# EAGLE board nixie_schema (EAGLE 8.2.0)
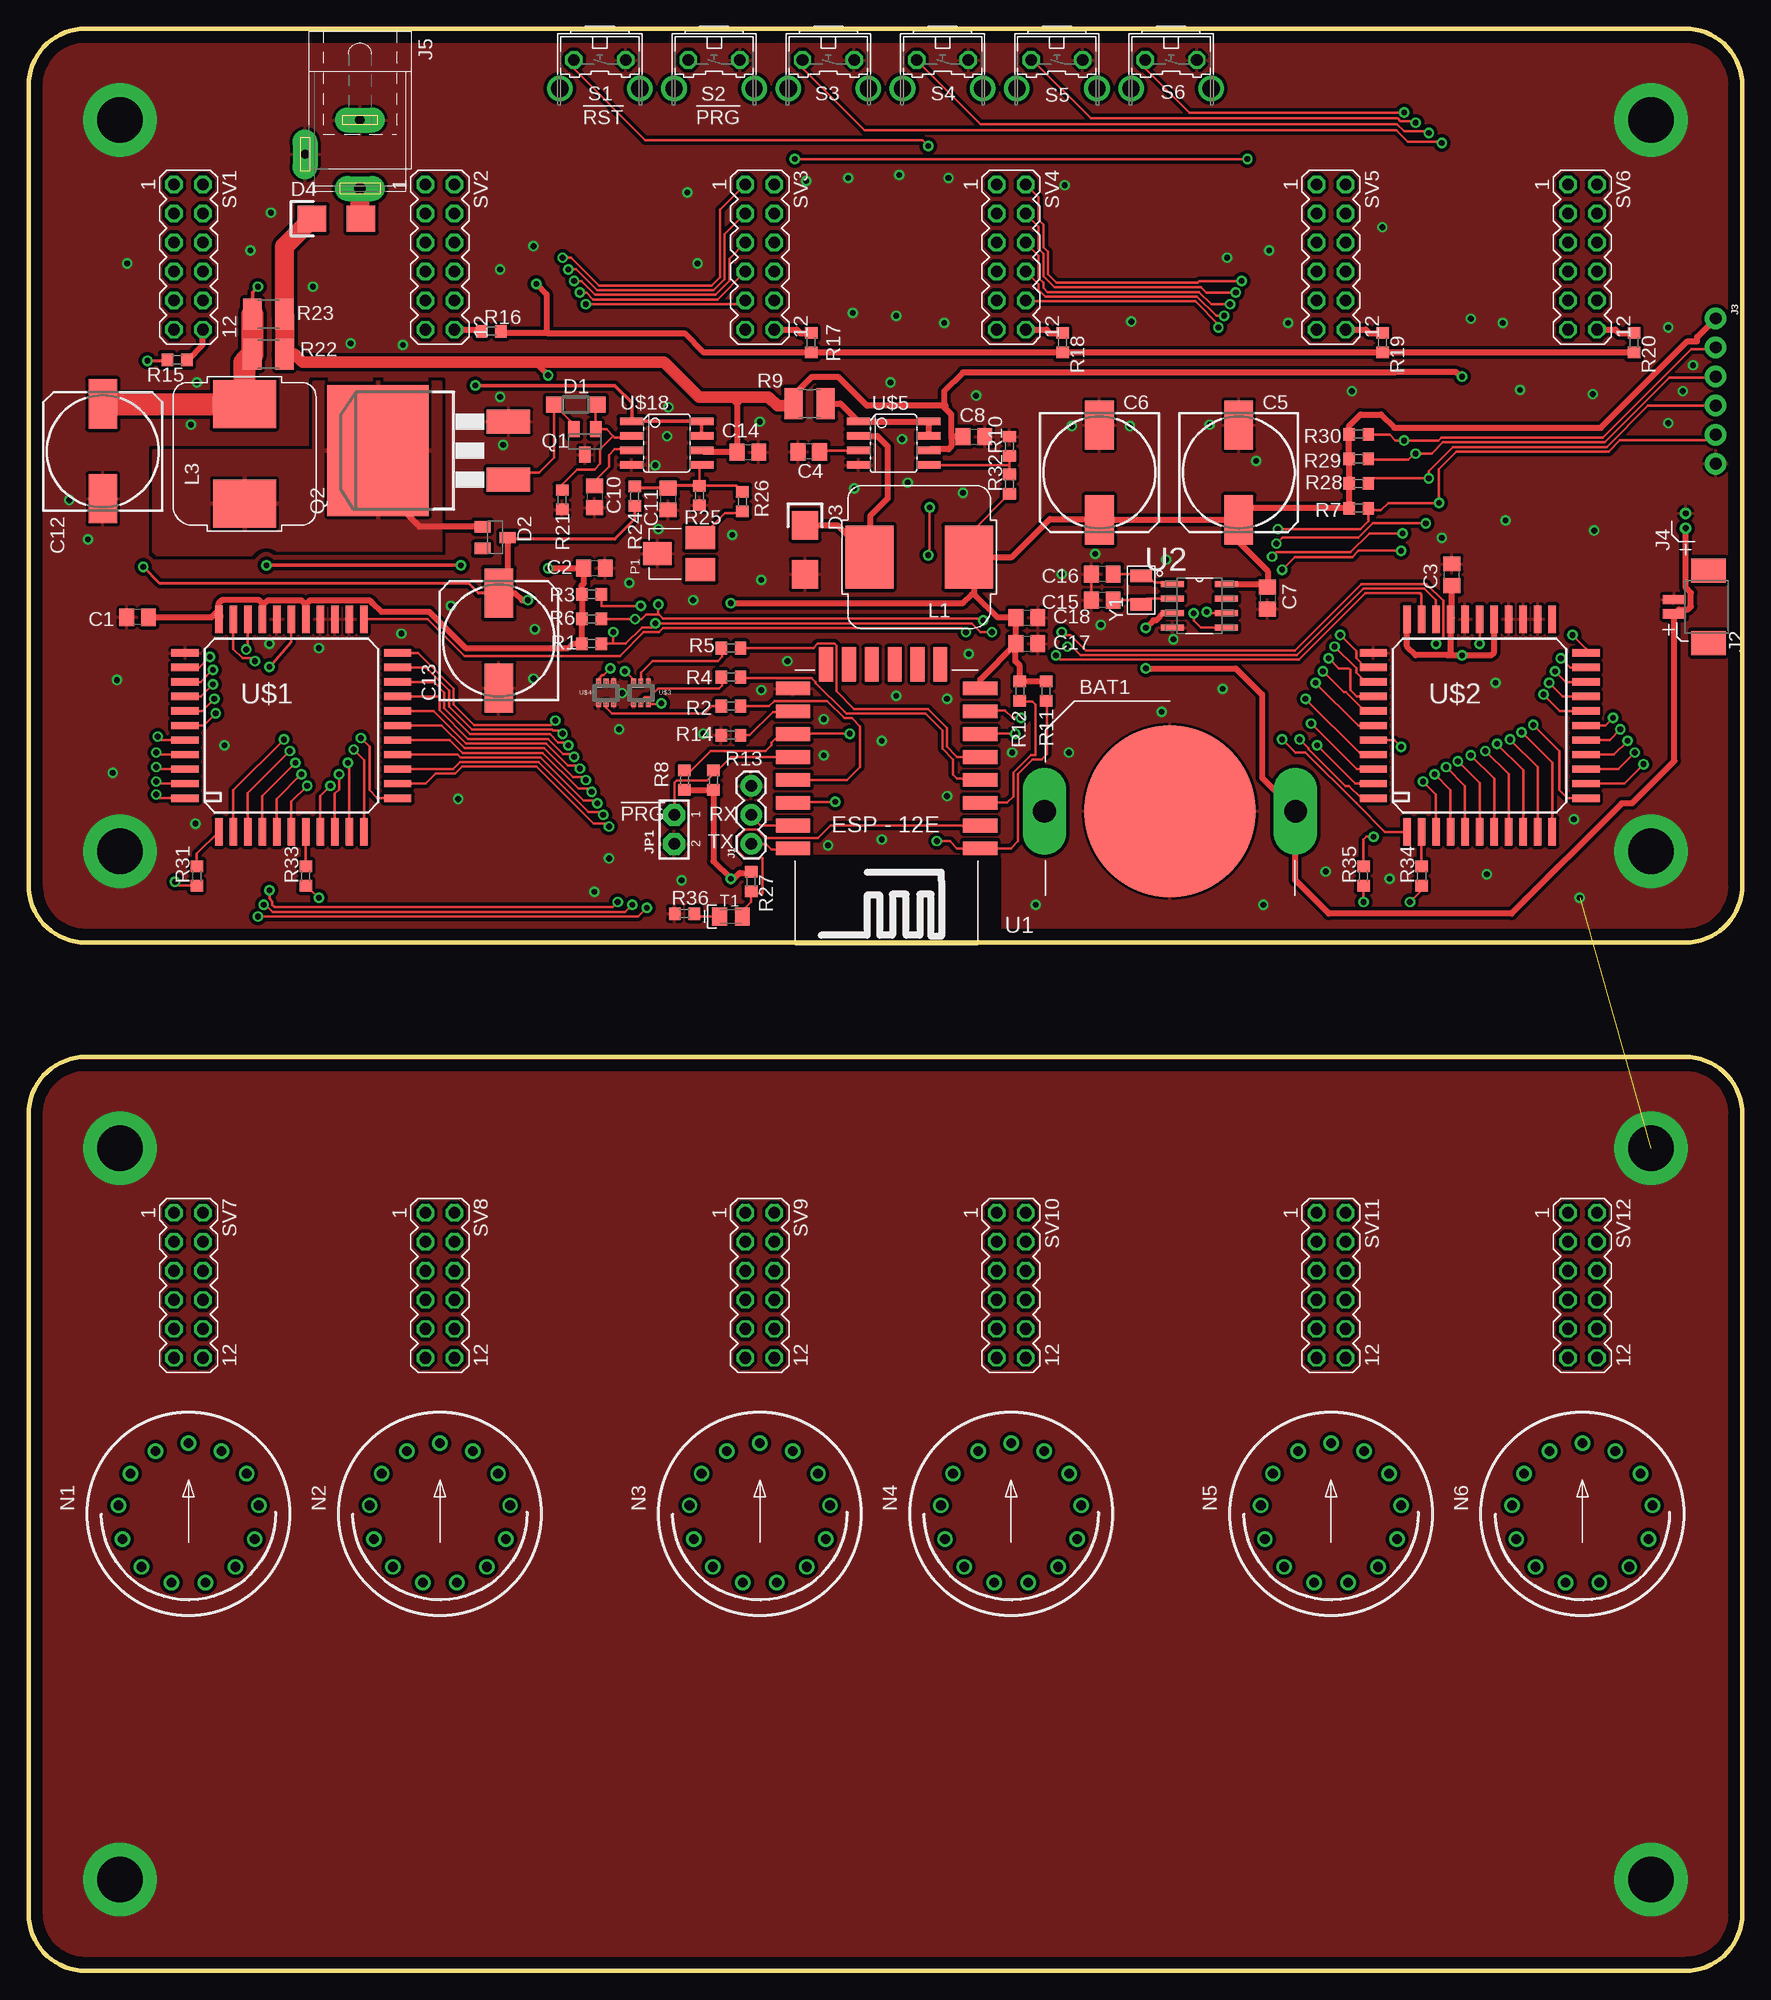
[diagram p5: board, top side]
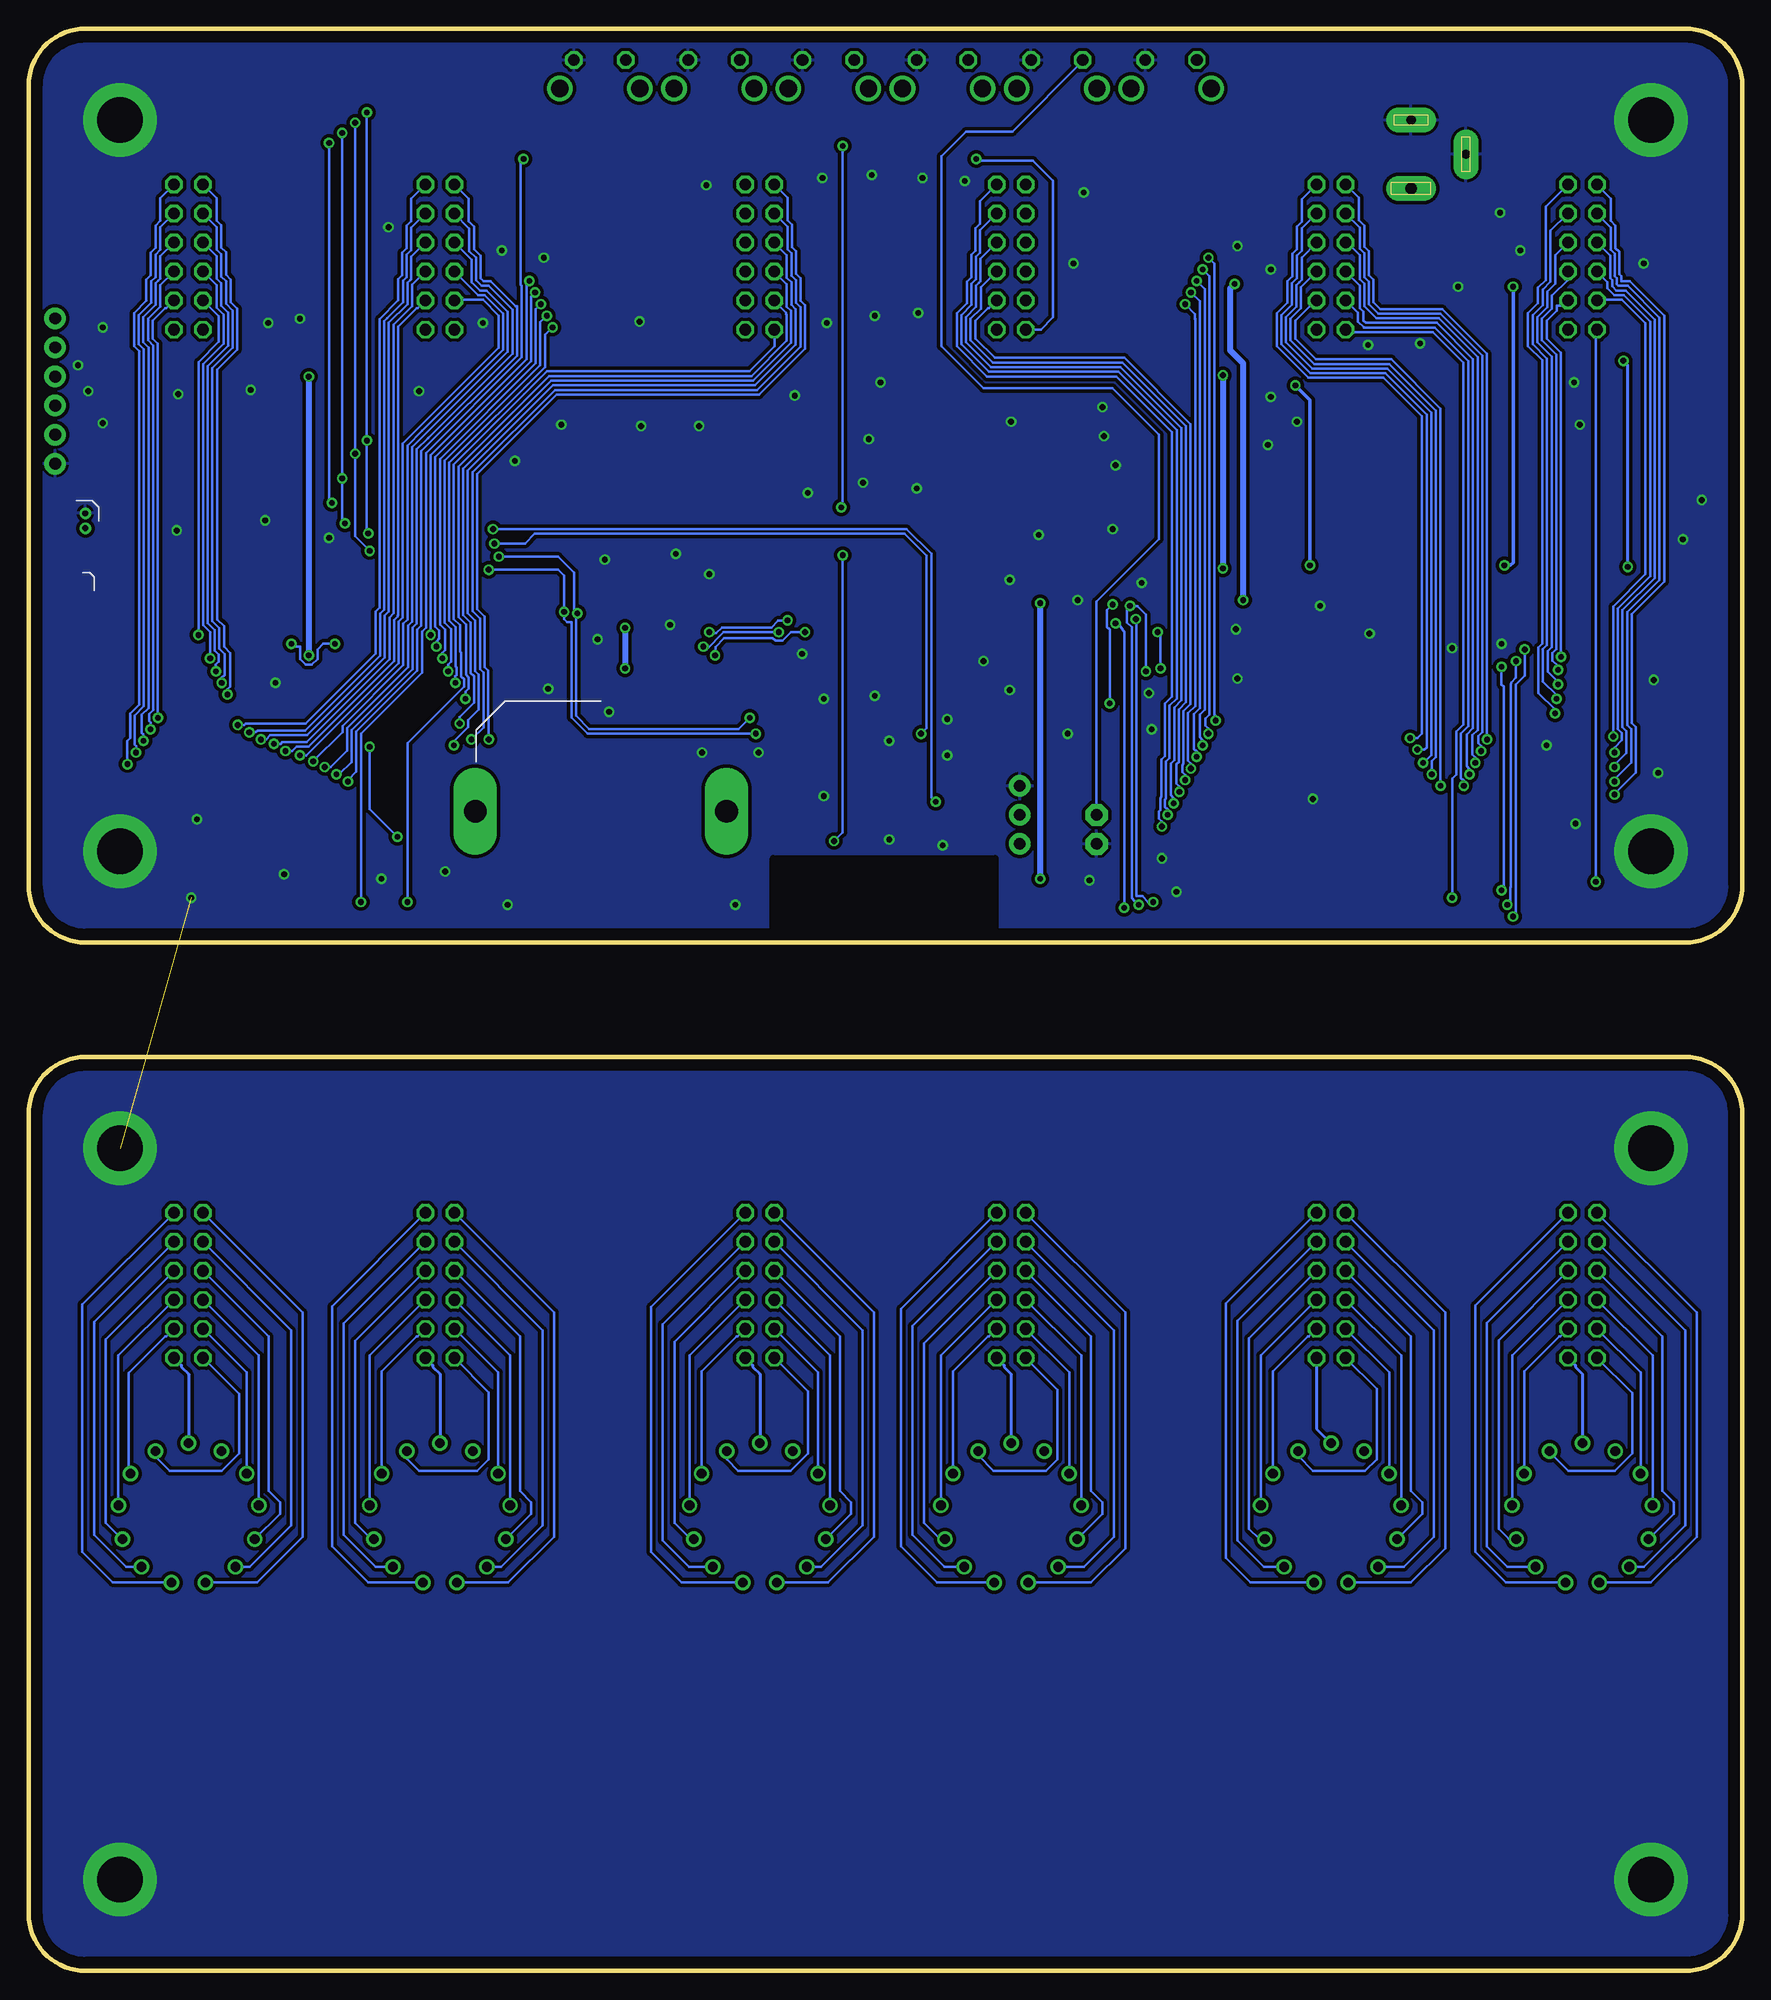
[diagram p6: board, bottom side, seen from below]

Size 150 x 170 mm. Coordinates in mm from the lower left corner, seen from the top.
Outline: 5,90 145,90 arc90 150,95 150,165 arc90 145,170 5,170 arc90 0,165 0,95 arc90 5,90
Outline: 5,0 145,0 arc90 150,5 150,75 arc90 145,80 5,80 arc90 0,75 0,5 arc90 5,0
Copper layers (1*16): Top 0.035mm / dielectric 1.5mm / Bottom 0.035mm
Design rules "default *": minimum track width 8mil, minimum drill 16mil, track to track 8mil, track to pad 8mil, pad to pad 8mil, via to via 8mil, smd to smd 8mil, copper to edge 40mil, drill to drill 8mil, minimum pad ring 10mil, minimum via ring 8mil, stop-mask expansion 4mil, vias tented up to drill 0.5mm, thermal gap 10mil
Net classes: 0 default: width 0.203 mm, drill 0.5 mm, clearance 0.203 mm; 1 Power: width 0.508 mm, drill 0.5 mm, clearance 0.203 mm; 2 HV: width 0.254 mm, drill 0.5 mm, clearance 1 mm; 3 medium power: width 0.508 mm, drill 0.5 mm, clearance 0.203 mm; 4 GND pour: width 0.305 mm, drill 0.5 mm, clearance 0.305 mm
tRestrict: area 65.4,90.3 to 84.8,97.4
bRestrict: area 65.4,90.3 to 84.8,97.4

## Footprints (pad centres in the part's own frame; a part is rotated, then mirrored left to right if it is on the bottom)
CR2032 = drill 2 pad 3.81 long: +_1 10.985,0; +_2 -10.985,0 | smd 15 x 15: - 0,0
C0805 = smd 1.3 x 1.5: 1 -0.95,0; 2 0.95,0
153CLV-1014 = smd 4.3 x 2.5: + 4.15,0; - -4.15,0
SOD123 = smd 1.4 x 1.4: A 1.9,0; C -1.9,0
SOT23 = smd 1 x 1.4: 1 -0.95,-1.1; 2 0.95,-1.1; 3 0,1.1
SMA/SMB = smd 2.5 x 2.3: A 2.15,0; C -2.15,0
1X03 = drill 1.016 pad 1.88: 1 0,0; 2 2.54,0; 3 5.08,0
PICOBLADE_SMD_2 = smd 0.8 x 2: + -0.625,3; - 0.625,3 | smd 2.1 x 3: CHAS_1 -3.175,0; CHAS_2 3.175,0
1X06_NO_SILK = drill 1.016 pad 1.88: 1 0,0; 2 2.54,0; 3 5.08,0; 4 7.62,0; 5 10.16,0; 6 12.7,0
PICOBLADE_THT_2 = drill 0.5: + -0.625,0; - 0.675,0
SPC4077 = drill 0.8 pad 2.184 long: 1 -3,0; 2 0,-4.8 | drill 1 pad 2.184 long: 3 3,0
JUMPER2 = drill 1 pad 1.93 octagon: 1 2.54,0; 2 0,0
INDUCTOR_PACKAGE = smd 5.5 x 4.2: P$1 0,4.35; P$2 0,-4.35
IN-14 = drill 0.84: 0 -5.094,-3.516; 1 5.094,-3.516; 2 6.145,-0.746; 3 5.788,2.195; 4 4.105,4.633; 5 1.481,6.01; 6 -1.481,6.01; 7 -4.105,4.633; 8 -5.788,2.195; 9 -6.145,-0.746; A 0,-6.19; LHDP 2.877,-5.481; RHDP -2.877,-5.481
UNI_POT_SMD = smd 2 x 2.6: P$1 -1.4,-1.9; P$3 1.4,-1.9 | smd 2 x 2.5: P$2 0,1.85
D2PACK = smd 2.083 x 3.81: 1 -2.54,-8.89; 3 2.54,-8.89 | smd 11.43 x 8.89: 2 0,2.54
R0603 = smd 1 x 1.1: 1 -0.85,0; 2 0.85,0
R1210 = smd 1.6 x 2.7: 1 -1.4,0; 2 1.4,0
B3F-31XX = drill 1.016 octagon: 1 -2.261,-1.245; 2 2.261,-1.245 | drill 1.499 pad 2.159: 3 -3.505,1.245; 4 3.505,1.245
MA06-2 = drill 1.016 octagon: 1 -6.35,-1.27; 2 -6.35,1.27; 3 -3.81,-1.27; 4 -3.81,1.27; 5 -1.27,-1.27; 6 -1.27,1.27; 7 1.27,-1.27; 8 1.27,1.27; 9 3.81,-1.27; 10 3.81,1.27; 11 6.35,-1.27; 12 6.35,1.27
C0805K = smd 1.3 x 1.6: COL 1,0; EMI -1,0
ESP12E-SMD = smd 3 x 1.2: ADC -8.3,3.8; CH_PD -8.3,1.8; GND 8.1,-8.2; GPIO0 8.1,-2.2; GPIO2 8.1,-4.2; GPIO4 8.1,-0.2; GPIO5 8.1,1.8; GPIO12 -8.3,-4.2; GPIO13 -8.3,-6.2; GPIO14 -8.3,-2.2; GPIO15 8.1,-6.2; GPIO16 -8.3,-0.2; RESET -8.3,5.8; RXD0 8.1,3.8; TXD0 8.1,5.8; VCC -8.3,-8.2 | smd 1.2 x 3: CS0 -4.8,-10.3; GPIO9 -0.8,-10.3; GPIO10 1.2,-10.3; MISO -2.8,-10.3; MOSI 3.2,-10.3; SCLK 5.2,-10.3
SOIC8-N_MC = smd 1.981 x 0.559: 1 -2.362,1.905; 2 -2.362,0.635; 3 -2.362,-0.635; 4 -2.362,-1.905; 5 2.362,-1.905; 6 2.362,-0.635; 7 2.362,0.635; 8 2.362,1.905
CQFP-44 = smd 0.65 x 2.4: 1 -6.35,-9.3; 2 -5.08,-9.3; 3 -3.81,-9.3; 4 -2.54,-9.3; 5 -1.27,-9.3; 6 0,-9.3; 7 1.27,-9.3; 8 2.54,-9.3; 9 3.81,-9.3; 10 5.08,-9.3; 11 6.35,-9.3; 23 6.35,9.3; 24 5.08,9.3; 25 3.81,9.3; 26 2.54,9.3; 27 1.27,9.3; 28 0,9.3; 29 -1.27,9.3; 30 -2.54,9.3; 31 -3.81,9.3; 32 -5.08,9.3; 33 -6.35,9.3 | smd 2.4 x 0.65: 12 9.3,-6.35; 13 9.3,-5.08; 14 9.3,-3.81; 15 9.3,-2.54; 16 9.3,-1.27; 17 9.3,0; 18 9.3,1.27; 19 9.3,2.54; 20 9.3,3.81; 21 9.3,5.08; 22 9.3,6.35; 34 -9.3,6.35; 35 -9.3,5.08; 36 -9.3,3.81; 37 -9.3,2.54; 38 -9.3,1.27; 39 -9.3,0; 40 -9.3,-1.27; 41 -9.3,-2.54; 42 -9.3,-3.81; 43 -9.3,-5.08; 44 -9.3,-6.35
SOT-363 = smd 0.42 x 0.6: 1 -0.65,-0.95; 2 0,-0.95; 3 0.65,-0.95; 4 0.65,0.95; 5 0,0.95; 6 -0.65,0.95
SOIC08 = smd 0.66 x 2.032: 1 -1.905,-3.073; 2 -0.635,-3.073; 3 0.635,-3.073; 4 1.905,-3.073; 5 1.905,3.073; 6 0.635,3.073; 7 -0.635,3.073; 8 -1.905,3.073
CRYSTAL_PACK = smd 1.1 x 1.9: P$1 -1.25,0; P$2 1.25,0

## Placement (x,y rotation side)
BAT1  CR2032  [CR2032]  99.91,101.5 0 top
C1  100n  [C0805]  9.54,118.47 180 top
C2  100n  [C0805]  49.53,122.77 0 top
C3  100n  [C0805]  124.58,122.2 90 top
C4  270p  [C0805]  68.29,132.96 180 top
C5  100u  [153CLV-1014]  105.92,131.15 270 top
C6  100u  [153CLV-1014]  93.73,131.15 270 top
C7  100n  [C0805]  108.42,120.15 270 top
C8  100n  [C0805]  82.74,134.29 0 top
C10  680p  [C0805]  49.54,129.02 270 top
C11  10n  [C0805]  55.98,128.82 270 top
C12  220u  [153CLV-1014]  6.5,133 90 top
C13  2.2u  [153CLV-1014]  41.16,116.44 90 top
C14  100n  [C0805]  62.96,132.94 0 top
C15  [C0805]  93.98,119.97 180 top
C16  [C0805]  93.98,122.26 180 top
C17  100n  [C0805]  87.38,116.16 0 top
C18  100n  [C0805]  87.38,118.45 0 top
D1  [SOD123]  47.9,137.09 0 top
D2  BAS21  [SOT23]  40.83,125.45 270 top
D3  B230A-13-F  [SMA/SMB]  67.96,124.38 270 top
D4  B230A-13-F  [SMA/SMB]  26.95,153.35 0 top
J1  [1X03]  63.25,98.64 90 top
J2  [PICOBLADE_SMD_2]  147.05,119.39 90 top
J3  [1X06_NO_SILK]  147.67,144.62 270 top
J4  [PICOBLADE_THT_2]  145.04,126.89 90 top
J5  [SPC4077]  29,159 270 top
JP1  [JUMPER2]  56.52,98.64 90 top
L1  100u  [INDUCTOR_PACKAGE]  77.95,123.75 90 top
L3  150u  [INDUCTOR_PACKAGE]  18.9,132.78 0 top
N1  IN-14_FIXED  [IN-14]  14,40 180 top
N2  IN-14_FIXED  [IN-14]  36,40 180 top
N3  IN-14_FIXED  [IN-14]  64,40 180 top
N4  IN-14_FIXED  [IN-14]  86,40 180 top
N5  IN-14_FIXED  [IN-14]  114,40 180 top
N6  IN-14_FIXED  [IN-14]  136,40 180 top
P1  100k  [UNI_POT_SMD]  56.9,124.04 90 top
Q1  BC856B  [SOT23]  48.69,133.83 180 top
Q2  IRF740S  [D2PACK]  33.12,133.06 90 top
R1  2.2k  [R0603]  49.28,116.16 0 top
R2  2.2k  [R0603]  61.47,110.7 180 top
R3  2.2k  [R0603]  49.28,120.48 0 top
R4  2.2k  [R0603]  61.47,113.24 180 top
R5  2.2k  [R0603]  61.47,115.78 180 top
R6  2.2k  [R0603]  49.28,118.32 0 top
R7  2.2K  [R0603]  116.42,128.02 180 top
R8  [R0603]  57.4,104.22 90 top
R9  0.5R  [R1210]  68.35,137.17 0 top
R10  3.3k  [R0603]  85.85,133.43 90 top
R11  [R0603]  89.05,112.01 90 top
R12  [R0603]  86.77,112.01 90 top
R13  [R0603]  59.94,104.22 90 top
R14  [R0603]  61.47,108.16 0 top
R15  10k  [R0603]  13,141 180 top
R16  10k  [R0603]  40.5,143.5 0 top
R17  10k  [R0603]  68.5,142.5 270 top
R18  10k  [R0603]  90.5,142.5 270 top
R19  10k  [R0603]  118.5,142.5 270 top
R20  10k  [R0603]  140.5,142.5 270 top
R21  1k  [R0603]  46.71,128.75 270 top
R22  0.5R  [R1210]  21,141.5 180 top
R23  0.5R  [R1210]  21,145 180 top
R24  330k  [R0603]  53.05,129.09 90 top
R25  3.3k  [R0603]  58.71,129.14 270 top
R26  5.6k  [R0603]  62.48,128.61 270 top
R27  [R0603]  63.25,95.33 270 top
R28  2.2K  [R0603]  116.42,130.18 180 top
R29  2.2K  [R0603]  116.42,132.34 180 top
R30  2.2K  [R0603]  116.42,134.5 180 top
R31  68k  [R0603]  14.73,95.84 90 top
R32  5.6k  [R0603]  85.85,130.13 90 top
R33  68k  [R0603]  24.26,95.84 90 top
R34  68k  [R0603]  121.92,95.84 90 top
R35  68k  [R0603]  116.84,95.84 90 top
R36  [R0603]  57.4,92.54 180 top
S1  [B3F-31XX]  50,166 180 top
S2  [B3F-31XX]  60,166 180 top
S3  [B3F-31XX]  70,166 180 top
S4  [B3F-31XX]  80,166 180 top
S5  [B3F-31XX]  90,166 180 top
S6  [B3F-31XX]  100,166 180 top
SV1  [MA06-2]  14,150 270 top
SV2  [MA06-2]  36,150 270 top
SV3  [MA06-2]  64,150 270 top
SV4  [MA06-2]  86,150 270 top
SV5  [MA06-2]  114,150 270 top
SV6  [MA06-2]  136,150 270 top
SV7  [MA06-2]  14,60 270 top
SV8  [MA06-2]  36,60 270 top
SV9  [MA06-2]  64,60 270 top
SV10  [MA06-2]  86,60 270 top
SV11  [MA06-2]  114,60 270 top
SV12  [MA06-2]  136,60 270 top
T1  [C0805K]  61.47,92.29 0 top
U1  [ESP12E-SMD]  75,104.05 180 top
U2  MC7940N  [SOIC8-N_MC]  102.48,119.47 0 top
U$1  HV5522  [CQFP-44]  23,109 0 top
U$2  HV5522  [CQFP-44]  127,109 0 top
U$3  BSS138DW  [SOT-363]  53.59,111.84 0 top
U$4  BSS138DW  [SOT-363]  50.55,111.84 0 top
U$5  MC34063  [SOIC08]  75.71,133.7 270 top
U$18  MC34063  [SOIC08]  55.85,133.73 270 top
Y1  [CRYSTAL_PACK]  97.39,120.86 90 top

## Tracks (layer width: path | path; a pad name or v marks a point on that pad's centre or on a via)
+3V3  (via drill 0.5)
  Top 0.203: L1.P$2 82.3,125.73 R32.1
  Top 0.508: C5.+ C6.+ 93.64,127.08 89.41,127.08 86.07,123.75 L1.P$2 82.8,123.24 82.8,120.48 | 83.57,112.52 U1.VCC 83.3,113.04 C17.1 | C17.1 C18.1 84.84,118.45 82.8,120.48 | U2.8 108.14,121.38 C7.1 108.46,121.14 108.46,122.51 105.92,125.05 C5.+ | 82.8,120.48 82.55,120.48 81.79,119.72 v61.47,119.72 | R27.1 63.16,96.1 62.23,96.1 61.47,95.33 v61.47,95.59 59.94,97.11 R13.1 R8.1 | R11.2 R12.2 86.77,114.23 86.36,114.64 86.36,116.1 C17.1 | C5.+ 106.94,128.02 R7.2 R28.2 R29.2 R30.2 115.57,135.21 116.59,136.23 118.36,136.23 119.54,135.06 137.61,135.06 145.18,142.63 146.05,142.63 146.05,143 J3.1
  Bottom 0.508: v61.47,119.72 v61.47,95.59
BUTTON1  (via drill 0.5)
  Top 0.203: S3.2 67.74,166.53 73.15,161.12 119.7,161.12 120.71,160.11 123.57,160.11 v123.7,159.98 | J3.5 147.18,133.97 139.29,133.97 138.3,132.98 124.97,132.98 123.44,131.45 v123.44,128.48 119,128.48 118.36,127.85 117.44,127.85 R7.1 117.27,126.88 116.59,126.19 v109.35,126.19 | v109.35,126.19 109.22,126.19 109.09,126.07 109.22,126.07 v109.35,126.19 | v70.61,102.32 66.97,102.32 U1.GPIO5
  Bottom 0.203: v123.7,159.98 123.7,128.74 v123.44,128.48 | v109.35,126.19 73.15,126.19 70.99,124.04 70.99,102.7 v70.61,102.32
BUTTON2  (via drill 0.5)
  Top 0.203: R8.2 58,105.07 59.69,106.76 64.52,106.76 65.02,107.27 65.02,107.53 65.53,108.03 66.68,108.03 U1.GPIO2 66.94,108.29 v71.88,108.29 | S4.2 77.74,167.2 83.31,161.63 119.77,161.63 120.4,161 122.42,161 v122.56,160.87 | R28.1 117.73,130.64 v122.56,130.64 122.56,131.28 124.66,133.38 138.13,133.38 141.74,136.99 147.66,136.99 J3.4 | v122.3,126.7 117.67,126.7 116.4,125.44 109.73,125.44 v109.22,124.92
  Bottom 0.203: v122.56,160.87 v122.56,130.64 122.56,126.96 v122.3,126.7 | v109.22,124.92 106.55,124.92 105.69,125.79 73.32,125.79 71.41,123.88 71.41,121.66 71.4,121.65 71.4,108.77 v71.88,108.29
BUTTON3  (via drill 0.5)
  Top 0.203: v86.36,108.29 84.2,108.29 83.82,107.91 83.64,107.91 U1.GPIO12 | 104.84,118.83 U2.6 103.24,118.84 v103.12,118.96 | S5.2 87.86,167.25 92.96,162.14 119.83,162.14 120.08,161.89 121.28,161.89 v121.41,161.75 | R29.1 117.31,132.29 120.78,132.29 121.28,132.8 v121.41,132.8 122.81,132.8 123.8,133.79 137.96,133.79 143.61,139.43 147.56,139.43 J3.3 | v120.14,124.29 116.41,124.29 115.88,123.76 110.85,123.76 v109.73,122.64
  Bottom 0.203: v86.36,108.29 101.09,108.29 102.49,109.69 102.49,118.07 102.87,118.07 103.12,118.32 v103.12,118.96 103.12,122.13 103.63,122.64 v109.73,122.64 | v121.41,161.75 v121.41,132.8 121.41,125.56 v120.14,124.29
BUTTON4  (via drill 0.5)
  Top 0.203: v86.87,109.69 86.11,109.69 85.47,110.32 83.37,110.32 U1.GPIO13 | U2.5 104.84,117.56 102.62,117.56 101.98,118.19 v101.98,118.83 | S6.2 97.74,166.5 101.6,162.64 v120.4,162.64 | 117.57,134.2 R30.1 117.31,134.45 119.13,134.45 119.63,133.94 v120.4,133.94 123.38,133.94 123.63,134.2 137.79,134.2 145.54,141.94 147.53,141.94 J3.2 | v120.27,125.81 117.35,125.81 115.71,124.17 109.22,124.17 v108.84,123.78
  Bottom 0.203: v86.87,109.69 87.85,108.7 100.93,108.7 102.08,109.85 102.08,118.73 v101.98,118.83 102.23,119.08 102.23,122.38 103.63,123.78 v108.84,123.78 | v120.4,162.64 v120.4,133.94 120.4,125.94 v120.27,125.81
DATA_CLK
  Top 0.203: R5.1 68.7,115.78 69.07,116.16 70.53,116.16 70.7,115.98 70.7,112 72.26,110.45 78.74,110.45 80.39,108.8 80.39,107.14 81.28,106.26 U1.GPIO14 | U1.GPIO14
DATA_IN
  Top 0.203: R4.1 62.4,113.16 68.53,113.16 68.89,112.79 68.89,112.72 71.4,110.22 71.58,110.04 78.49,110.04 79.98,108.54 79.98,106.98 80.93,106.03 80.93,104.7 81.28,104.35 83.2,104.35 U1.GPIO16
GND  (via drill 0.5, 4 pad 6.45)  (1 unrouted)
  Top 0.203: C15.2 93.03,122.07 93.22,122.26
  other vias: 142,98 142,162 8,162 8,98 142,72 142,8 8,8 8,72 21.08,116.16 25.4,115.78 44.32,117.43 51.94,111.84 41.27,137.75 38.99,135.59 41.53,133.56 100.2,116.54 64.14,112.1 54.86,131.78 36.96,119.46 44.2,113.11 32.64,117.05 59.05,108.29 96.39,135.21 91.31,135.21 103.38,135.34 107.44,132.16 90.42,122.26 75.95,111.59 74.68,107.65 74.68,99.02 80.39,102.83 113.54,96.22 75.44,139.02 96.52,144.36 143.51,135.47 82.93,137.88 115.82,138.26 130.56,138.39 136.91,138.01 137.03,126.07 126.24,144.61 129.03,144.23 143.51,143.85 129.29,126.96 128.4,112.73 127.64,95.97 135.76,93.94 88.14,93.3 57.15,95.46 50.8,97.37 37.59,102.57 17.14,107.27 14.61,100.41 7.37,104.86 7.75,112.99 5.21,125.31 3.56,128.74 8.64,149.44 19.43,150.58 21.21,153.88 24.89,147.4 41.27,148.93 44.2,150.96 58.55,149.44 57.66,155.66 68.07,156.68 72.14,145.12 75.95,144.86 76.2,157.18 71.75,156.93 80.14,144.23 80.52,156.93 90.68,156.29 104.9,149.94 108.58,150.58 118.49,152.61 81.79,129.37 72.26,129.75 64.01,135.59 61.59,125.69 55.88,134.32 56.01,136.86 76.45,134.07 76.96,130.26 64.14,121.75 58.17,119.97 80.39,111.34 69.98,98.51 49.53,94.44 51.69,108.67 14.22,135.34 14.73,139.02 28.19,142.45 32.77,142.32 110.24,144.23 135.25,100.8 108.08,93.3 104.52,112.22 99.19,110.19 91.06,106.64 82.3,115.27 66.42,114.64 69.6,106.38 119.13,95.59 86.11,106.64 69.6,109.56 52.58,121.5 93.85,117.81 93.34,124.04 99.57,123.53 55.12,126.19 123.7,125.43 144.78,138.26 145.67,140.55
  pour Top (isolate 0.305, rank 2): -1,90 0,170 150,170 150,90
  pour Bottom (isolate 0.305, rank 2): 0,89 0,170 150,170 150,90
  pour Bottom (isolate 0.305, rank 2): 0,0 150,0 150,80 0,81
  pour Top (isolate 0.305, rank 2): -1,80 0,0 150,0 150,80
HV_DATA_CLK  (via drill 0.5)
  Top 0.203: U$1.28 23,116.3 v21.08,114.13 | v21.08,94.57 21.08,93.87 21.33,93.62 21.33,93.31 21.54,93.1 51.1,93.1 v51.56,93.56 | 55.18,118.7 55.53,118.35 83.41,118.35 v83.57,118.19 | v123.19,116.16 123.82,116.79 123.82,119.92 122.34,121.39 116.67,121.39 110.86,115.58 92.53,115.58 91.19,116.92 90.68,116.92 v90.42,117.18 | v127,116.16 U$2.28 | 55.18,118.7 54.04,118.7 53.66,118.32 v53.09,118.32 R6.2 | U$3.3 55.31,110.89 v55.37,110.95 | v55.12,119.59 55.12,118.76 55.18,118.7
  Bottom 0.203: v21.08,114.13 21.08,112.61 20.88,112.4 20.88,94.78 v21.08,94.57 | v51.56,93.56 52.01,93.56 52.52,94.06 53.03,94.06 53.03,117.89 v53.09,118.32 | v83.57,118.19 84.38,118.19 84.99,117.58 89.32,117.58 89.82,117.08 90.33,117.08 v90.42,117.18 | v123.19,116.16 124.21,116.16 124.72,115.65 124.72,114.83 125.22,114.33 125.73,114.33 126.23,114.83 126.23,115.9 126.24,115.91 126.75,115.91 v127,116.16 | v55.37,110.95 55.37,117.38 55.62,117.63 55.62,119.09 v55.12,119.59
HV_DATA_IN  (via drill 0.5)
  Top 0.203: U$1.32 17.92,115.71 18.74,114.9 19.05,114.9 19.05,114.89 19.56,114.89 v19.81,114.64 | v20.57,93.3 20.76,93.3 21.37,92.69 52.22,92.69 v52.83,93.3 | v53.59,119.46 50.16,119.46 50.16,120.44 R3.2 | U$3.6 52.94,113 v52.2,113.75
  Bottom 0.203: v19.81,114.64 19.81,113.18 20.22,112.77 20.22,112.71 20.28,112.64 20.28,94.86 20.32,94.83 20.32,93.56 v20.57,93.3 | v52.83,93.3 53.18,93.65 53.2,93.65 53.44,93.9 53.44,117.61 53.84,118.01 53.84,118.32 53.85,118.32 53.85,119.21 v53.59,119.46 52.96,119.46 52.2,118.7 v52.2,113.75
HV_DATA_OUT  (via drill 0.5)
  Top 0.203: 29.35,118.33 U$1.23 29.37,118.32 34.92,118.32 38.15,115.09 51.77,115.09 53.85,117.18 55.17,117.18 55.53,117.53 81.69,117.53 v82.04,117.18 | U$2.32 121.92,120.48 121.83,120.57 117,120.57 111.19,114.77 90.3,114.77 v89.92,115.15
  Bottom 0.203: v82.04,117.18 83.26,117.18 84.01,116.42 84.07,116.42 84.64,116.42 84.86,116.64 89.11,116.64 89.88,115.88 89.88,115.18 v89.92,115.15
HV_HA_0  (via drill 0.5)
  Top 0.203: U$1.35 14.94,114.08 v15.88,115.02
  Bottom 0.203: v15.88,115.02 15.88,141.62 17.13,142.88 17.13,144.42 16.26,145.3 16.26,145.75 15.71,145.75 SV1.10
HV_HA_1  (via drill 0.5)
  Top 0.203: U$1.40 11.61,107.73 v11.3,108.03
  Bottom 0.203: v11.3,108.03 11.3,119.42 8.48,122.25 8.48,123.54 8.51,123.57 8.51,144.23 10.54,146.26 12.66,146.26 SV1.9
HV_HA_2  (via drill 0.5)
  Top 0.203: U$1.41 11.35,106.46 v11.18,106.64
  Bottom 0.203: v11.18,106.64 11.18,107.09 10.54,107.72 10.54,108.35 10.9,108.7 10.9,119.26 8.07,122.08 8.07,144.37 10.37,146.67 11.2,146.67 11.81,147.28 11.81,147.81 SV1.7
HV_HA_3  (via drill 0.5)
  Top 0.203: U$1.42 11.35,105.19 v11.18,105.37
  Bottom 0.203: v11.18,105.37 11.18,105.56 10.14,106.6 10.14,108.52 10.49,108.87 10.49,119.09 7.67,121.91 7.67,144.53 10.2,147.07 11.03,147.07 11.4,147.44 11.4,147.98 11.57,148.15 11.57,150.11 SV1.5
HV_HA_4  (via drill 0.5)
  Top 0.203: U$1.43 11.35,103.92 v11.18,104.1
  Bottom 0.203: v11.18,104.1 11.18,104.3 9.73,105.74 9.73,108.69 10.08,109.04 10.08,118.92 7.26,121.74 7.26,144.7 10.04,147.48 10.87,147.48 11,147.61 11,148.15 11.17,148.32 11.17,150.28 11.51,150.62 11.51,152.59 SV1.3
HV_HA_5  (via drill 0.5)
  Top 0.203: U$1.44 11.48,102.65 v11.18,102.95
  Bottom 0.203: v11.18,102.95 11.18,103.03 9.33,104.88 9.33,108.85 9.68,109.2 9.68,118.75 6.85,121.58 6.85,144.87 9.87,147.89 10.59,147.89 10.59,148.32 10.76,148.49 10.76,150.45 11.1,150.79 11.1,152.76 11.51,153.16 11.51,155.13 SV1.1
HV_HA_6  (via drill 0.5)
  Top 0.203: U$1.39 15.32,109 v16.38,110.07
  Bottom 0.203: v16.38,110.07 16.38,110.39 17.85,111.86 17.85,115.84 17.53,116.16 17.53,140.97 18.76,142.2 18.76,145.09 17.88,145.97 17.88,147.31 17.2,148 17.2,154.42 SV1.2
HV_HA_7  (via drill 0.5)
  Top 0.203: U$1.38 15.19,110.27 v16.26,111.34
  Bottom 0.203: v16.26,111.34 16.26,111.66 17.45,112.85 17.45,115.67 17.09,116.02 17.09,141.11 18.35,142.37 18.35,144.93 17.48,145.81 17.48,147.14 16.79,147.83 16.79,152.29 SV1.4
HV_HA_8  (via drill 0.5)
  Top 0.203: U$1.37 15.06,111.54 v16.13,112.61
  Bottom 0.203: v16.13,112.61 16.13,112.8 17.04,113.71 17.04,115.5 16.69,115.85 16.69,141.28 17.95,142.54 17.95,144.76 17.07,145.64 17.07,146.97 16.38,147.66 16.38,150.16 SV1.6
HV_HA_9  (via drill 0.5)
  Top 0.203: U$1.36 15.06,112.81 v16.13,113.88
  Bottom 0.203: v16.13,113.88 16.13,114.2 16.63,114.7 16.63,115.33 16.28,115.69 16.28,141.45 17.54,142.71 17.54,144.59 16.66,145.47 16.66,146.62 15.24,148.04 15.24,148.7 SV1.8
HV_HA_DP
  Top 0.203: U$1.1 14.73,97.78 R31.2
HV_HB_0  (via drill 0.5)
  Top 0.203: U$1.8 25.54,102.84 v26.42,103.72
  Bottom 0.203: v26.42,103.72 26.42,136.74 30.73,141.05 37.31,141.05 39.13,142.88 39.13,144.42 37.85,145.71 37.85,146.13 37.33,146.13 SV2.10
HV_HB_1  (via drill 0.5)
  Top 0.203: U$1.6 23,102.33 v24.38,103.72
  Bottom 0.203: v24.38,103.72 24.38,104.17 24.63,104.42 24.63,108.29 24,108.93 24,140.8 24,140.91 26.92,143.83 33.15,143.83 33.15,143.85 33.66,144.36 33.66,145.12 SV2.9
HV_HB_2  (via drill 0.5)
  Top 0.203: U$1.5 21.73,102.59 v23.88,104.73
  Bottom 0.203: v23.88,104.73 23.88,105.18 24.13,105.43 24.13,108.23 23.59,108.76 23.59,141.08 26.75,144.24 32.96,144.24 33.18,144.45 33.18,145.21 33.5,145.53 33.5,147.5 SV2.7
HV_HB_3  (via drill 0.5)
  Top 0.203: U$1.4 20.46,102.84 v23.37,105.75
  Bottom 0.203: v23.37,105.75 23.37,106.2 23.62,106.45 23.62,108.16 23.16,108.61 23.16,141.22 26.59,144.65 32.04,144.65 33.09,145.7 33.09,147.66 33.5,148.07 33.5,150.18 34.66,151.34 SV2.5
HV_HB_4  (via drill 0.5)
  Top 0.203: U$1.3 19.19,103.09 v22.86,106.76
  Bottom 0.203: v22.86,106.76 22.86,107.22 23.11,107.47 23.11,108.09 22.76,108.45 22.76,141.39 26.42,145.05 31.87,145.05 32.68,145.87 32.68,147.83 33.09,148.24 33.09,150.35 33.49,150.75 33.49,152.57 SV2.3
HV_HB_5  (via drill 0.5)
  Top 0.203: U$1.2 17.92,103.35 v22.35,107.78
  Bottom 0.203: v22.35,107.78 22.35,141.44 | 22.35,141.44 22.35,141.56 | 22.35,141.44 22.35,141.56 | 22.35,141.56 26.25,145.46 31.7,145.46 32.28,146.04 32.28,148 32.68,148.41 32.68,150.51 33.08,150.91 33.08,152.74 33.56,153.21 33.56,155.18 SV2.1
HV_HB_6  (via drill 0.5)
  Top 0.203: U$1.12 30.53,102.65 29.84,103.34 29.84,107.14 v29.08,107.91
  Bottom 0.203: v29.08,107.91 28.45,107.91 28.04,108.31 28.04,136.06 31.41,139.43 37.98,139.43 40.76,142.2 40.76,144.09 | 40.76,144.09 | 40.76,144.09 40.76,145.09 39.84,146.02 39.84,147.88 39.38,148.34 39.38,150.31 38.98,150.71 38.98,152.68 38.57,153.08 38.57,155.05 SV2.2
HV_HB_7  (via drill 0.5)
  Top 0.203: U$1.11 29.35,105.99 v28.45,106.89
  Bottom 0.203: v28.45,106.89 27.81,106.89 27.64,107.07 27.64,136.23 31.24,139.84 37.81,139.84 40.35,142.37 40.35,144.25 | 40.35,144.25 | 40.35,144.25 40.35,144.93 39.43,145.85 39.43,147.72 38.98,148.17 38.98,150.14 38.57,150.54 38.57,152.51 SV2.4
HV_HB_8  (via drill 0.5)
  Top 0.203: U$1.10 28.08,105.61 v27.94,105.75
  Bottom 0.203: v27.94,105.75 27.88,105.75 27.23,106.4 27.23,136.4 31.07,140.24 37.65,140.24 39.95,142.54 39.95,144.42 | 39.95,144.42 | 39.95,144.42 39.95,144.76 39.03,145.68 39.03,147.55 38.79,147.79 | 38.79,147.79 | 38.79,147.79 38.57,148 38.57,149.97 SV2.6
HV_HB_9  (via drill 0.5)
  Top 0.203: U$1.9 26.81,103.04 27.17,103.4 v27.17,104.73 v27.18,104.73
  Bottom 0.203: v27.18,104.73 27.18,105.88 26.82,106.23 26.82,136.57 30.9,140.65 37.48,140.65 39.54,142.71 39.54,144.59 38.62,145.51 38.62,147.38 SV2.8
HV_HB_DP
  Top 0.203: R33.2 24.26,99.69 U$1.7
HV_IN+  (via drill 0.5)
  Top 0.254: R24.1 53.05,127.04 51.31,125.31 42.07,125.31 D2.3 | C13.+ 39.39,120.59 38.52,121.46 38.5,121.44 11.49,121.44 v10.03,122.89 | v10.41,140.93 12.08,140.93 R15.2 | 45.34,143.47 45.47,143.34
  Top 0.508: D2.3 41.93,121.36 C13.+ 42.56,120.59 43.18,119.97 v43.69,119.97 | R20.2 R19.2 R18.2 R17.2 59.09,141.65 57.4,143.34 45.47,143.34 41.51,143.34 R16.2 | v44.45,147.66 45.34,146.77 45.34,143.47
  Bottom 0.254: v10.03,122.89 10.03,140.55 v10.41,140.93
  Bottom 0.508: v43.69,119.97 43.69,140.67 44.83,141.82 44.83,147.28 v44.45,147.66
HV_LE  (via drill 0.5)
  Top 0.203: U$1.31 19.19,115.79 v19.05,115.65 | v20.07,92.29 53.34,92.29 v54.1,93.05 | U$2.31 123.19,119.97 122.17,120.99 116.84,120.99 111.02,115.17 92.05,115.17 91.31,115.91 v90.93,115.91 | v84.33,117.18 83.31,117.18 82.55,117.94 v54.86,117.94 54.51,117.58 53.68,117.58 52.26,116.16 51.31,116.16 | 51.31,116.16 R1.2 | v51.18,117.18 51.18,116.29 51.31,116.16 | v50.93,114 50.32,113.4 50.21,113.4 49.9,113.09 U$4.6
  Bottom 0.203: v19.05,115.65 19.05,113.37 19.81,112.61 19.81,92.54 v20.07,92.29 | v54.1,93.05 54.1,117.18 54.61,117.94 v54.86,117.94 | v84.33,117.18 89.15,117.18 90.68,115.65 v90.93,115.91 | v50.93,114 50.93,116.92 v51.18,117.18
HV_MA_0  (via drill 0.5)
  Top 0.203: U$1.17 36.16,109 38.15,107.02 45.14,107.02 47.68,104.48 48.51,104.48 v48.77,104.22
  Bottom 0.203: v48.77,104.22 48.77,104.68 49.02,104.93 49.02,105.55 48.92,105.66 48.92,110.25 48.29,110.87 48.29,132.04 | 48.29,132.04 48.29,132.13 | 48.29,132.04 48.29,135.37 54.1,141.18 65.44,141.18 67.13,142.88 67.13,144.42 66.04,145.51 65.95,145.51 SV3.10
HV_MA_1  (via drill 0.5)
  Top 0.203: U$1.18 35.47,110.27 38.32,107.42 45.31,107.42 47.24,105.5 48,105.5 v48.26,105.24 | v48.77,145.88 62.42,145.88 SV3.9
  Bottom 0.203: v48.26,105.24 48.26,105.69 48.51,105.94 48.51,110.08 47.88,110.7 47.88,144.48 | 47.88,144.48 47.87,144.49 | 47.88,144.48 47.88,144.55 47.9,144.57 47.9,145.02 v48.77,145.88
HV_MA_2  (via drill 0.5)
  Top 0.203: U$1.19 35.98,111.54 35.98,110.34 38.48,107.83 45.48,107.83 46.8,106.51 47.49,106.51 v47.75,106.26 | v48.26,146.9 48.82,146.9 49.43,146.29 60.29,146.29 SV3.7
  Bottom 0.203: v47.75,106.26 47.75,106.71 48,106.96 48,110.01 47.47,110.54 47.47,144.71 47.5,144.74 47.5,146.13 v48.26,146.9
HV_MA_3  (via drill 0.5)
  Top 0.203: U$1.20 35.48,112.81 36.38,111.9 36.38,110.51 38.65,108.24 45.65,108.24 46.35,107.53 46.99,107.53 v47.24,107.27 | v47.75,147.91 48.38,147.91 49.6,146.69 60.12,146.69 61.34,147.91 61.34,149.88 SV3.5
  Bottom 0.203: v47.24,107.27 47.24,107.72 47.49,107.97 47.49,109.94 47.04,110.4 47.04,147.2 v47.75,147.91
HV_MA_4  (via drill 0.5)
  Top 0.203: U$1.21 34.78,114.08 36.8,112.06 36.8,110.67 38.82,108.64 45.82,108.64 45.91,108.55 46.48,108.55 v46.74,108.29 | v47.24,148.93 47.94,148.93 49.77,147.1 59.95,147.1 60.93,148.08 60.93,152.01 SV3.3
  Bottom 0.203: v46.74,108.29 46.74,108.74 46.99,108.99 46.99,109.62 46.63,109.97 46.63,148.32 v47.24,148.93
HV_MA_5  (via drill 0.5)
  Top 0.203: U$1.22 34.09,115.35 37.2,112.23 37.2,110.84 38.99,109.05 45.72,109.05 v46.1,109.43 | v46.74,149.94 47.5,149.94 49.94,147.51 59.78,147.51 60.53,148.25 60.53,154.15 SV3.1
  Bottom 0.203: v46.1,109.43 46.1,109.81 46.23,109.94 46.23,149.44 v46.74,149.94
HV_MA_6  (via drill 0.5)
  Top 0.203: U$1.13 34.75,103.92 35.61,104.78 37.33,104.78 37.94,105.39 44.47,105.39 49.44,100.42 50.54,100.42 v50.8,100.16
  Bottom 0.203: v50.8,100.16 50.8,100.61 51.05,100.86 51.05,101.49 50.95,101.59 50.95,102.67 50.85,102.78 50.85,106.02 50.54,106.33 50.54,110.92 49.91,111.55 49.91,134.69 54.77,139.56 66.11,139.56 68.76,142.2 68.76,145.09 67.87,145.98 67.87,147.85 67.48,148.24 67.48,150.21 67.14,150.55 67.14,152.52 66.73,152.92 66.73,154.89 SV3.2
HV_MA_7  (via drill 0.5)
  Top 0.203: U$1.14 37.16,105.19 37.77,105.8 44.64,105.8 49,101.43 50.03,101.43 v50.29,101.18
  Bottom 0.203: v50.29,101.18 50.29,101.63 50.54,101.88 50.54,102.51 50.44,102.61 50.44,105.86 50.14,106.16 50.14,110.75 49.51,111.38 49.51,134.86 54.61,139.96 65.94,139.96 68.35,142.37 68.35,144.93 67.47,145.81 67.47,147.68 67.08,148.07 67.08,150.04 66.73,150.38 66.73,152.35 SV3.4
HV_MA_8  (via drill 0.5)
  Top 0.203: U$1.15 37.56,106.46 37.81,106.2 44.81,106.2 48.56,102.45 49.53,102.45 v49.78,102.19
  Bottom 0.203: v49.78,102.19 49.78,102.64 50.03,102.89 50.03,105.69 49.73,105.99 49.73,110.58 49.1,111.21 49.1,135.03 54.44,140.37 65.77,140.37 67.95,142.54 67.95,144.76 67.06,145.65 67.06,147.51 66.82,147.75 | 66.82,147.75 | 66.82,147.75 66.67,147.91 66.67,149.87 SV3.6
HV_MA_9  (via drill 0.5)
  Top 0.203: U$1.16 36.86,107.73 37.98,106.61 44.98,106.61 48.12,103.47 49.02,103.47 v49.28,103.21
  Bottom 0.203: v49.28,103.21 49.28,103.66 49.53,103.91 49.53,105.62 49.32,105.82 49.32,110.41 48.7,111.04 48.7,135.2 54.27,140.78 65.61,140.78 67.54,142.71 67.54,144.59 66.65,145.48 66.65,147.35 SV3.8
HV_MA_DP
  Top 0.203: U$2.2 R34.2
HV_MB_0  (via drill 0.5)
  Top 0.203: U$2.39 116.38,109 v112.65,112.73 | v104.14,143.85 104.14,144.1 102.11,146.13 87.33,146.13 SV4.10
  Bottom 0.203: v112.65,112.73 112.65,113.31 112.53,113.44 112.53,114.06 112.63,114.16 112.63,117.61 113.18,118.17 113.18,132 104.8,140.38 104.8,143.19 v104.14,143.85
HV_MB_1  (via drill 0.5)
  Top 0.203: U$2.41 116.64,106.46 v111.76,111.34
  Bottom 0.203: v111.76,111.34 111.76,111.97 111.48,112.25 111.48,113.22 111.71,113.44 111.71,117.85 112.37,118.5 112.37,131.66 104.44,139.59 86.74,139.59 83.66,142.67 83.66,144.96 83.69,144.99 83.69,145.15 SV4.9
HV_MB_2  (via drill 0.5)
  Top 0.203: 116.89,105.19 U$2.42 116.25,105.19 v112.27,109.18
  Bottom 0.203: v112.27,109.18 112.27,109.76 111,111.02 111,113.31 111.31,113.61 111.31,118.01 111.96,118.67 111.96,131.49 104.27,139.19 86.57,139.19 83.26,142.5 83.26,145.29 83.64,145.68 83.64,147.64 SV4.7
HV_MB_3  (via drill 0.5)
  Top 0.203: U$2.43 116.13,103.92 v112.78,107.27
  Bottom 0.203: SV4.5 83.64,150.18 83.64,148.22 83.24,147.81 83.24,145.84 82.85,145.46 82.85,142.33 86.4,138.78 104.1,138.78 111.56,131.32 111.56,118.84 110.9,118.18 110.9,113.78 110.6,113.48 110.6,110.41 111.51,109.5 111.51,108.86 112.78,107.6 v112.78,107.27
HV_MB_4  (via drill 0.5)
  Top 0.203: U$2.44 116.64,102.65 115.57,103.72 115.26,103.72 112.02,106.96 112.02,107.01 v111.25,107.78
  Bottom 0.203: SV4.3 83.58,152.66 83.58,150.69 83.24,150.35 83.24,148.38 82.83,147.98 82.83,146.01 82.44,145.63 82.44,142.16 86.23,138.37 103.94,138.37 111.15,131.16 111.15,119.01 110.49,118.35 110.49,113.95 110.19,113.64 110.19,108.84 v111.25,107.78
HV_MB_5  (via drill 0.5)
  Top 0.203: U$2.1 118.69,99.7 116.19,102.2 111.76,106.64 110.87,106.64 v109.73,107.78
  Bottom 0.203: v109.73,107.78 109.73,109.58 109.78,109.63 109.78,113.81 110.09,114.12 110.09,118.52 110.74,119.18 110.74,130.99 103.77,137.97 86.07,137.97 82.04,142 82.04,145.8 82.42,146.18 82.42,148.15 82.83,148.55 82.83,150.52 83.17,150.86 83.17,152.83 83.58,153.23 83.58,155.2 SV4.1
HV_MB_6  (via drill 0.5)
  Top 0.203: v114.81,116.92 116.19,115.54 116.19,114.9 117.01,114.08 U$2.35 | v106.17,147.91 102.49,147.91 102.34,147.76 89.97,147.76 89.22,148.5 89.22,150.47 88.81,150.88 88.81,152.85 88.4,153.25 88.4,155.22 SV4.2
  Bottom 0.203: v114.81,116.92 114.81,132.67 106.43,141.05 106.43,147.66 v106.17,147.91
HV_MB_7  (via drill 0.5)
  Top 0.203: v114.3,115.91 116.19,114.01 116.19,113.63 117.01,112.81 U$2.36 | v105.66,146.9 103.07,146.9 102.61,147.35 89.8,147.35 88.81,148.34 88.81,150.3 88.4,150.71 88.4,152.68 SV4.4
  Bottom 0.203: v114.3,115.91 114.3,116.36 114.05,116.61 114.05,117.31 114.4,117.66 114.4,132.5 106.02,140.89 106.02,146.54 v105.66,146.9
HV_MB_8  (via drill 0.5)
  Top 0.203: U$2.37 116.25,111.54 115.7,112.1 115.7,113.88 115.57,114 114.68,114 v113.79,114.89 | v105.16,145.88 103.51,145.88 102.44,146.95 89.17,146.95 88.81,147.31 88.81,147.77 88.4,148.17 88.4,150.14 SV4.6
  Bottom 0.203: v113.79,114.89 113.79,115.34 113.54,115.59 113.54,117.38 114,117.83 114,132.34 105.61,140.72 105.61,145.42 v105.16,145.88
HV_MB_9  (via drill 0.5)
  Top 0.203: U$2.38 116.95,110.27 115.29,111.93 115.1,111.93 v113.28,113.75 | v104.65,144.86 103.95,144.86 102.28,146.54 89,146.54 88.39,147.15 88.39,147.61 SV4.8
  Bottom 0.203: v113.28,113.75 113.28,114.33 113.03,114.58 113.03,117.44 113.59,118 113.59,132.17 105.21,140.55 105.21,143.21 105.21,144.31 v104.65,144.86
HV_MB_DP  (via drill 0.5)
  Top 0.203: U$2.40 119.56,107.73 v120.14,107.14 | R35.2 116.84,99.02 117.09,99.27 v117.73,99.27
  Bottom 0.203: v120.14,107.14 120.14,101.68 v117.73,99.27
HV_SA_0  (via drill 0.5)
  Top 0.203: U$2.8 129.54,104.73 v127.51,106.76
  Bottom 0.203: v127.51,106.76 126.93,106.76 126.55,107.14 125.5,107.14 118.01,114.63 118.01,118.24 117.7,118.55 117.7,118.6 117.65,118.65 117.65,143.9 116.04,145.51 115.95,145.51 SV5.10
HV_SA_1  (via drill 0.5)
  Top 0.203: U$2.7 128.27,104.35 v126.24,106.38
  Bottom 0.203: v126.24,106.38 125.68,106.38 117.6,114.46 117.6,118.08 117.25,118.43 117.25,133.68 108.86,142.06 108.86,144.89 110.24,146.26 112.66,146.26 SV5.9
HV_SA_2  (via drill 0.5)
  Top 0.203: U$2.6 127,103.97 v125.09,105.88
  Bottom 0.203: v125.09,105.88 122.53,108.44 122.53,108.96 117.2,114.3 117.2,117.91 116.84,118.26 116.84,133.51 115.55,134.81 108.46,141.9 108.46,143.72 | 108.46,143.72 108.46,143.85 | SV5.7 110.67,146.67 110.07,146.67 108.46,145.06 108.46,143.72
HV_SA_3  (via drill 0.5)
  Top 0.203: U$2.5 125.73,103.72 v124.08,105.37
  Bottom 0.203: v124.08,105.37 123.57,105.37 122.12,106.81 122.12,108.79 116.79,114.13 116.79,117.74 116.43,118.09 116.43,133.34 108.05,141.73 108.05,145.23 109.9,147.07 110.5,147.07 111.23,147.81 111.23,149.77 SV5.5
HV_SA_4  (via drill 0.5)
  Top 0.203: U$2.4 124.46,103.34 v123.06,104.73
  Bottom 0.203: v123.06,104.73 122.81,104.73 121.72,105.82 121.72,108.62 116.38,113.96 116.38,117.57 116.03,117.93 116.03,133.18 115.03,134.17 107.64,141.56 107.64,145.39 109.73,147.48 110.33,147.48 110.83,147.97 110.83,149.94 111.42,150.54 111.42,152.5 SV5.3
HV_SA_5  (via drill 0.5)
  Top 0.203: U$2.3 123.19,102.95 v122.05,104.1
  Bottom 0.203: v122.05,104.1 122.05,104.22 121.31,104.96 121.31,108.46 115.98,113.79 115.98,117.4 115.62,117.76 115.62,133.01 107.24,141.39 107.24,145.7 107.38,145.7 109.56,147.89 110.16,147.89 110.42,148.14 110.42,150.11 111.02,150.7 111.02,152.67 111.48,153.14 111.48,155.11 SV5.1
HV_SA_6  (via drill 0.5)
  Top 0.203: U$2.12 134.67,102.65 133.99,103.34 133.99,106.76 v131.7,109.05
  Bottom 0.203: v131.7,109.05 131.12,109.05 131,109.17 125.77,109.17 119.63,115.31 119.63,118.97 119.28,119.33 119.28,143.57 | 119.28,143.57 | 119.28,143.57 119.28,144.58 117.64,146.22 117.64,148.09 117.31,148.41 117.31,150.38 116.9,150.79 116.9,152.75 116.5,153.16 116.5,155.12 SV5.2
HV_SA_7  (via drill 0.5)
  Top 0.203: U$2.11 133.35,105.75 v130.68,108.41
  Bottom 0.203: v130.68,108.41 130.1,108.41 129.96,108.56 125.8,108.56 119.23,115.14 119.23,118.8 118.87,119.16 118.87,143.73 | 118.87,143.73 | 118.87,143.73 118.87,144.41 118.63,144.65 | 118.63,144.65 | 118.63,144.65 117.23,146.05 117.23,147.92 116.9,148.25 116.9,150.21 116.5,150.62 116.5,152.58 SV5.4
HV_SA_8  (via drill 0.5)
  Top 0.203: U$2.10 132.08,105.37 v129.67,107.78
  Bottom 0.203: v129.67,107.78 129.22,107.78 128.84,108.16 125.63,108.16 118.82,114.97 118.82,118.63 118.47,118.99 118.47,143.9 | 118.47,143.9 | 118.47,143.9 118.47,144.24 116.83,145.88 116.83,147.75 116.59,147.99 | 116.59,147.99 | 116.59,147.99 116.5,148.08 116.5,150.04 SV5.6
HV_SA_9  (via drill 0.5)
  Top 0.203: U$2.9 130.81,105.11 v128.52,107.4
  Bottom 0.203: v128.52,107.4 127.94,107.4 127.8,107.55 125.67,107.55 118.42,114.8 118.42,118.46 118.06,118.82 118.06,144.07 116.42,145.71 116.42,147.58 SV5.8
HV_SB_0  (via drill 0.5)
  Top 0.203: U$2.17 138,109 v138.68,109.69
  Bottom 0.203: v138.68,109.69 138.68,142.43 139.13,142.88 139.13,144.42 138.04,145.51 137.95,145.51 SV6.10
HV_SB_1  (via drill 0.5)
  Top 0.203: U$2.22 136.3,115.75 v135.13,116.92
  Bottom 0.203: v135.13,116.92 135.13,140.8 133.35,142.58 133.35,144.81 SV6.9
HV_SB_2  (via drill 0.5)
  Top 0.203: U$2.21 134.92,114.08 v134.11,114.89
  Bottom 0.203: v134.11,114.89 134.11,117.18 134.72,117.79 134.72,140.63 132.94,142.41 132.94,144.98 133.53,145.57 133.53,147.53 SV6.7
HV_SB_3  (via drill 0.5)
  Top 0.203: U$2.20 134.54,112.81 v133.6,113.75
  Bottom 0.203: v133.6,113.75 133.6,114.33 133.35,114.58 133.35,115.21 133.71,115.56 133.71,117.35 134.31,117.96 134.31,140.46 132.54,142.24 132.54,145.15 133.13,145.74 133.13,147.7 133.53,148.11 133.53,150.07 SV6.5
HV_SB_4  (via drill 0.5)
  Top 0.203: U$2.19 134.29,111.54 v133.1,112.73
  Bottom 0.203: v133.1,112.73 133.1,113.19 132.85,113.44 132.85,115.27 133.3,115.73 133.3,117.52 133.91,118.12 133.91,140.3 132.13,142.07 132.13,145.31 132.72,145.91 132.72,147.87 133.13,148.28 133.13,150.24 133.53,150.65 133.53,152.61 SV6.3
HV_SB_5  (via drill 0.5)
  Top 0.203: U$2.18 134.03,110.27 v132.59,111.72
  Bottom 0.203: v132.59,111.72 132.59,112.17 132.34,112.42 132.34,115.34 132.89,115.89 132.89,117.68 133.5,118.29 133.5,140.13 131.72,141.91 131.72,145.48 132.31,146.07 132.31,148.04 132.72,148.45 132.72,150.41 133.13,150.82 133.13,152.78 133.53,153.19 133.53,155.15 SV6.1
HV_SB_6  (via drill 0.5)
  Top 0.203: U$2.13 139.65,103.92 v141.35,105.62
  Bottom 0.203: v141.35,105.62 141.35,107.65 141.12,107.89 141.12,110.05 140.31,110.86 140.31,111.34 140.31,141.75 140.76,142.2 140.76,143.47 140.76,145.09 139.69,146.17 139.69,146.39 139.69,148.04 139.3,148.43 139.3,148.67 139.3,150.39 138.89,150.8 138.89,150.96 138.89,152.76 138.48,153.17 138.48,155.14 SV6.2
HV_SB_7  (via drill 0.5)
  Top 0.203: U$2.14 139.14,105.19 v140.59,106.64
  Bottom 0.203: v140.59,106.64 140.59,107.22 140.71,107.34 140.71,109.88 139.9,110.69 139.9,141.92 140.35,142.37 140.35,144.93 139.28,146 139.28,147.87 138.89,148.26 138.89,150.22 138.48,150.63 138.48,152.6 SV6.4
HV_SB_8  (via drill 0.5)
  Top 0.203: U$2.15 138.76,106.46 v139.95,107.65
  Bottom 0.203: v139.95,107.65 139.95,108.23 140.08,108.36 140.08,109.94 139.5,110.52 139.5,142.09 139.95,142.54 139.95,144.76 138.87,145.83 138.87,147.7 138.63,147.94 | 138.63,147.94 | 138.63,147.94 138.48,148.09 138.48,150.06 SV6.6
HV_SB_9  (via drill 0.5)
  Top 0.203: U$2.16 138.38,107.73 v139.32,108.67
  Bottom 0.203: v139.32,108.67 139.32,109.25 139.44,109.37 139.44,110 139.09,110.35 139.09,142.26 139.54,142.71 139.54,144.59 138.47,145.66 138.47,147.53 SV6.8
LE
  Top 0.203: R2.1 64.82,110.7 65.27,111.16 69.89,111.16 71.41,109.63 72.06,109.63 72.77,108.92 72.77,105.37 71.63,104.22 66.93,104.22 U1.GPIO4
N$1
  Bottom 0.203: N2.RHDP 38.88,45.06 37.59,43.77 33.02,43.77 32,44.79 32,50.92 SV8.11
N$2
  Bottom 0.203: SV7.2 23.37,58.25 23.37,36.66 20.7,33.99 N1.6
N$3
  Top 0.203: U$4.2 50.55,110.57 51.05,110.07 59.18,110.07 59.82,110.7 R2.2
N$4
  Top 0.203: U$3.2 53.73,111.03 53.73,111.32 53.91,111.5 54.39,111.5 55.12,112.22 60.45,112.22 60.71,112.48 60.71,113.15 R4.2
N$5
  Top 0.508: R9.2 71.06,137.17 U$5.1 U$5.8 U$5.7
N$6
  Bottom 0.203: SV7.4 22.35,56.73 22.35,37.17 20.55,35.37 N1.7
N$7
  Bottom 0.203: SV7.6 21.34,55.2 21.34,38.69 20.45,37.8 N1.8
N$8
  Top 0.508: SV4.12 89.1,143.65 89.41,143.34 R18.1
N$9
  Top 0.203: U$3.5 53.59,113.62 54.61,114.64 60.33,114.64 60.71,115.02 60.71,115.69 R5.2
N$10
  Bottom 0.254: SV7.12 14.62,53 14.62,52.87 14,52.25 N1.A
N$11
  Top 0.508: SV3.12 67.25,143.65 67.56,143.34 R17.1
N$12
  Top 0.203: U$5.3 69.35,133.06 C4.1
N$13
  Top 0.508: D3.C 70.82,126.53 73.23,124.12 | 73.23,124.12 L1.P$1 | U$5.2 74.28,134.33 75.18,133.43 75.18,128.86 73.66,127.34 73.66,124.54 73.23,124.12
N$14  (via drill 0.5)
  Top 0.203: R11.1 89.15,111.06 89.15,106.51 88.65,106 87.88,106 86.61,104.73 86.61,98.89 85.97,98.25 U1.RESET 81.28,98.25 80.64,98.89 v79.5,98.89 | S1.2 47.74,166.47 53.98,160.23 78.23,160.23 v78.74,159.72 | v78.87,128.1 78.87,124.04 v78.74,123.91
  Bottom 0.203: v78.74,159.72 78.74,128.23 v78.87,128.1 | v78.74,123.91 78.74,99.65 v79.5,98.89
N$15
  Top 0.203: 60.29,105.07 R13.2 | 60.29,105.07 61.47,106.26 U1.GPIO0 | 60.29,105.07 59.39,104.18 56.73,104.18 56.55,104 56.55,101.21 JP1.1
  Bottom 0.203: S2.2 57.74,167.13 63.88,160.99 67.94,160.99 70.1,158.83 70.1,142.2 66.42,138.51 55.12,138.51 51.05,134.45 51.05,125.31 56.52,119.84 JP1.1
N$16
  Top 0.203: U1.CH_PD 85.66,102.25 86.21,102.8 86.21,104.9 87.72,106.41 88.14,106.41 88.14,110.83 87.88,111.08 86.85,111.08 R12.1
N$17
  Top 0.203: J1.1 64.54,98.61 65.02,98.13 66.78,98.13 U1.TXD0
N$18
  Top 0.203: U1.RXD0 64.08,100.25 J1.2
N$19
  Bottom 0.254: SV8.12 37.27,47.46 N2.A
N$20
  Top 0.203: 66.8,110.15 U1.GPIO15 66.96,110.19 67.56,110.19 65.15,110.19 63.12,108.16 R14.2
N$21
  Bottom 0.254: SV9.12 64.62,53 64.62,52.87 64,52.25 N3.A
N$22  (via drill 0.5)
  Top 0.508: J4.+ 145.04,121.07 145.5,120.61 145.5,119.43 145.24,119.16 144.44,119.16 J2.+ 144.05,105.9 140.34,102.19 139.45,102.19 129.79,92.54 113.79,92.54 110.87,95.46 110.87,101.47 BAT1.+_1 107.95,104.44 107.95,111.72 105.66,114 v97.79,114 | v97.79,117.56 98.43,118.2 98.7,118.2 99.34,118.84 U2.3
  Bottom 0.508: v97.79,117.56 v97.79,114
N$23
  Bottom 0.203: SV8.2 45.21,58.41 45.21,36.15 43.05,33.99 N2.6
N$24
  Bottom 0.203: SV7.8 20.14,53.85 N1.9
N$25
  Bottom 0.203: SV7.9 8.91,52.37 N1.1
N$26
  Bottom 0.203: SV7.7 7.86,53.85 N1.2
N$27
  Bottom 0.203: SV7.5 7,55.54 7,42 6,41 6,40 8.2,37.8 N1.3
N$28
  Bottom 0.203: SV7.3 5,56.08 5,39 8.63,35.37 N1.4
N$29
  Bottom 0.203: SV7.1 4,57.62 4,38 8.01,33.99 N1.5
N$30
  Bottom 0.203: SV7.11 9.65,50.57 9.65,45.3 11.18,43.77 15.24,43.77 16.88,45.41 N1.RHDP
N$31
  Bottom 0.203: SV8.4 44.2,56.88 44.2,37.68 41.89,35.37 N2.7
N$32
  Bottom 0.203: SV8.6 43.18,55.36 43.18,38.69 42.29,37.8 N2.8
N$33
  Bottom 0.203: SV8.8 42.15,53.85 N2.9
N$34
  Bottom 0.203: SV8.10 37.95,55.51 38.04,55.51 41.09,52.46 N2.0
N$35
  Bottom 0.203: SV9.11 59.94,50.86 59.94,44.79 60.96,43.77 65.53,43.77 66.88,45.12 N3.RHDP
N$36
  Bottom 0.203: SV9.2 73.66,57.96 73.66,37.17 70.48,33.99 N3.6
N$37
  Bottom 0.203: SV9.4 72.64,56.44 72.64,38.18 69.83,35.37 N3.7
N$38
  Bottom 0.203: SV8.1 26,57.62 26,37 29.01,33.99 N2.5
N$39
  Bottom 0.203: SV8.3 27,56.08 27,38 29.63,35.37 N2.4
N$40
  Bottom 0.203: SV8.5 29,55.54 29,42 28,41 28,40 30.2,37.8 N2.3
N$41
  Bottom 0.203: SV8.7 29.86,53.85 N2.2
N$42
  Bottom 0.203: SV8.9 30.91,52.37 N2.1
N$43
  Bottom 0.203: SV9.6 71.63,54.91 71.63,39.2 70.23,37.8 N3.8
N$44
  Bottom 0.203: SV9.8 70.14,53.85 N3.9
N$45
  Bottom 0.254: SV12.12 136.62,53 136.62,52.87 136,52.25 N6.A
N$46
  Bottom 0.203: SV9.10 65.95,55.51 66.04,55.51 69.09,52.46 N3.0
N$47
  Bottom 0.203: SV10.11 81.79,50.71 81.79,45.3 83.31,43.77 87.88,43.77 88.88,44.77 N4.RHDP
N$48
  Bottom 0.203: SV10.2 95.5,58.12 95.5,36.66 92.83,33.99 N4.6
N$49
  Bottom 0.203: SV9.1 54,57.62 54,37 57.01,33.99 N3.5
N$50
  Bottom 0.203: SV9.3 55,56.08 55,38 57.63,35.37 N3.4
N$51
  Bottom 0.203: SV9.5 57,55.54 57,42 56,41 56,40 58.2,37.8 N3.3
N$52
  Bottom 0.203: SV9.7 57.85,53.85 N3.2
N$53
  Bottom 0.203: SV9.9 58.91,52.37 N3.1
N$54
  Bottom 0.203: SV10.4 94.49,56.59 94.49,37.68 92.18,35.37 N4.7
N$55
  Bottom 0.203: SV10.6 93.47,55.07 93.47,39.2 92.08,37.8 N4.8
N$56
  Bottom 0.203: SV10.8 92.14,53.85 N4.9
N$57
  Bottom 0.203: SV10.10 87.95,55.51 88.04,55.51 91.09,52.46 N4.0
N$58
  Bottom 0.203: SV11.11 109.73,50.65 109.73,44.79 110.74,43.77 115.82,43.77 116.88,44.83 N5.RHDP
N$59
  Bottom 0.203: SV10.1 76,57.62 76,38 80.01,33.99 N4.5
N$60
  Bottom 0.203: SV10.3 77,56.08 77,39 80.63,35.37 N4.4
N$61
  Bottom 0.203: SV10.5 79,55.54 79,42 78,41 78,40 80.19,37.8 N4.3
N$62
  Bottom 0.203: SV10.7 79.86,53.85 N4.2
N$63
  Bottom 0.203: SV10.9 80.91,52.37 N4.1
N$64
  Bottom 0.203: SV11.2 123.44,58.18 123.44,37.17 120.27,33.99 N5.6
N$65
  Bottom 0.203: SV11.4 122.43,56.65 122.43,38.18 119.61,35.37 N5.7
N$66
  Bottom 0.203: SV11.6 121.41,55.13 121.41,39.2 120.02,37.8 N5.8
N$67
  Bottom 0.203: SV11.8 120.14,53.85 N5.9
N$68
  Bottom 0.203: SV11.10 115.95,55.51 116.04,55.51 119.09,52.46 N5.0
N$69
  Bottom 0.203: SV11.1 104,57.62 104,38 108.01,33.99 N5.5
N$70
  Bottom 0.203: SV11.3 105,56.08 105,39 108.63,35.37 N5.4
N$71
  Bottom 0.203: SV11.5 107,55.54 107,42 106,41 106,40 108.19,37.8 N5.3
N$72
  Bottom 0.203: SV11.7 107.86,53.85 N5.2
N$73
  Bottom 0.203: SV11.9 108.91,52.37 N5.1
N$74
  Top 0.203: C10.1 49.54,130.39 50.8,131.66 50.8,132.67 51.31,133.18 52.69,133.18 U$18.3
N$75
  Bottom 0.203: SV12.11 131.57,50.49 131.57,45.3 133.1,43.77 137.67,43.77 138.88,44.98 N6.RHDP
N$76
  Bottom 0.203: SV12.2 145.29,58.33 145.29,36.66 142.62,33.99 N6.6
N$77
  Bottom 0.203: SV12.4 144.27,56.81 144.27,38.18 141.46,35.37 N6.7
N$78
  Bottom 0.203: SV12.6 143.26,55.28 143.26,39.2 141.86,37.8 N6.8
N$79
  Bottom 0.203: SV12.8 142.15,53.85 N6.9
N$80
  Bottom 0.203: SV12.1 126,57.62 126,38 130.01,33.99 N6.5
N$81
  Bottom 0.203: SV12.3 127,56.08 127,39 130.63,35.37 N6.4
N$82
  Bottom 0.203: SV12.5 129,55.54 129,42 128,41 128,40 130.19,37.8 N6.3
N$83
  Bottom 0.203: SV12.7 129.85,53.85 N6.2
N$84
  Bottom 0.203: SV12.9 130.91,52.37 N6.1
N$85
  Top 0.203: D1.A 49.64,136.93 Q1.1 50.57,134.93 51.18,134.32 | 51.18,134.32 51.31,134.2 52.61,134.2 U$18.2 | R21.1 46.71,130.11 48.01,131.4 49.53,131.4 50.04,131.91 50.04,133.18 51.18,134.32
N$86
  Bottom 0.203: SV12.10 137.95,55.51 138.04,55.51 141.22,52.33 141.22,43.26 141.09,43.39 N6.0
N$87  (via drill 0.5)
  Top 0.305: R23.2 19.6,146.94 v20.07,147.4 | U$18.1 U$18.8 U$18.7 | U$18.1 52.78,135.78 | v20.83,123.02 v37.85,123.02 | v39.12,138.77 51.31,138.77 52.83,137.24 52.83,135.69 U$18.1
  Top 1.016: 19.6,137.83 L3.P$1
  Top 1.93: C12.+ 18.9,137.15 L3.P$1 18.9,140.8 R22.2 R23.2
  Bottom 0.305: v20.07,147.4 20.07,123.27 20.32,123.02 v20.83,123.02 | v37.85,123.02 37.85,137.5 v39.12,138.77
N$88
  Bottom 0.254: SV10.12 86.62,53 86.62,52.87 86,52.25 N4.A
N$89
  Top 0.508: R15.1 13.92,141 15.24,142.32 15.24,143.62 SV1.12
N$90
  Top 0.508: SV2.12 39.5,143.65 R16.1
N$91
  Top 0.508: SV6.12 138.88,143.65 139.19,143.34 R20.1
N$92
  Top 0.508: SV5.12 117.04,143.65 117.35,143.34 R19.1
N$93
  Top 1.016: D4.A 29,153.35
  Top 1.676: 29,153.35 J5.3
N$94
  Bottom 0.203: SV7.10 15.95,55.51 16.04,55.51 19.09,52.46 N1.0
N$95
  Top 0.203: Q1.2 47.74,135.35 D1.C 46,132.44 44.7,131.15 42.64,131.15 Q2.1
N$96
  Top 0.203: U$18.5 58.71,131.62 R25.1 61.95,129.99 R26.1 | 56.2,129.99 C11.1 | 53.22,129.77 R24.2
  Top 0.254: R25.1 56.2,129.99 | C11.1 53.22,129.77
N$97
  Top 0.203: P1.P$3 60.96,127.59 62.32,127.59 R26.2
N$98
  Bottom 0.254: SV11.12 114.62,53 114.62,52.87 114,52.25 N5.A
N$99
  Top 0.203: U2.1 100,121.5 98.55,121.5 97.93,122.11 Y1.P$2 97.25,122.26 C16.1
N$100
  Top 0.203: 99.98,119.97 U2.2 97.89,120.11 Y1.P$1 97.03,119.97 C15.1
N$103
  Top 0.203: 85.85,131.66 R32.2 | 85.85,131.66 R10.1 | U$5.5 85.72,131.79 85.85,131.66
N$106  (via drill 0.5)
  Top 0.203: R31.1 13.17,94.99 v12.83,95.33
  Bottom 0.203: v12.83,95.33 12.83,143.55 SV1.11
N$108  (via drill 0.5)
  Top 0.203: R33.1 24.26,94.95 v25.4,93.94
  Bottom 0.203: v25.4,93.94 25.4,104.35 25.04,104.71 25.04,108.46 24.4,109.1 24.4,140.74 27.09,143.43 34.51,143.43 | 34.51,143.43 SV2.11 34.51,143.43
N$109
  Top 0.203: T1.EMI 58.51,92.29 R36.1
N$110  (via drill 0.5)
  Top 0.203: v67.06,158.58 v106.68,158.58 | R34.1 121.92,94.57 v120.9,93.56
  Bottom 0.203: SV3.11 61.41,143.65 60.33,144.74 60.33,156.68 62.1,158.45 66.93,158.45 v67.06,158.58 | v120.9,93.56 120.9,108.29 115.57,113.62 115.57,117.23 115.21,117.59 115.21,132.84 106.83,141.22 106.83,147.5 106.93,147.6 106.93,157.69 | 106.93,157.69 | 106.93,157.69 106.93,158.33 v106.68,158.58
N$112  (via drill 0.5)
  Top 0.203: R35.1 v116.84,93.56
  Bottom 0.203: v116.84,93.56 116.84,106.51 116.84,107.47 111.89,112.42 111.89,113.05 112.12,113.28 112.12,115.38 112.22,115.48 112.22,117.78 112.78,118.33 112.78,131.83 104.61,140 86.91,140 84.71,142.2 84.71,143.63 SV4.11
PHOTO
  Top 0.203: T1.COL 62.47,92.78 63.25,93.56 R27.2 63.41,94.32 64.26,94.32 64.26,96.22 | U1.ADC 70.19,100.25 69.1,99.16 65.27,99.16 64.47,99.17 63.76,99.88 62.73,99.88 62,99.15 62,98.12 62.73,97.39 64.26,97.39 64.26,96.22 | 64.26,96.22 64.26,96.8
V_PULSE
  Top 0.508: D2.1 34.21,126.4 30.48,130.13 30.48,132.96 Q2.2
  pour Top: 25,139 25,133 11,133 11,124 36,124 36,139
VCC  (via drill 0.5)
  Top 0.508: 62.01,137.46 C14.1 59.08,132.94 U$18.6 | R9.1 66.95,137.9 68.58,139.53 70.87,139.53 73.41,136.99 80.01,136.99 | 80.01,136.99 80.77,136.23 80.77,134.2 | 80.77,134.2 80.77,133.43 80.52,133.18 78.9,133.18 U$5.6 | U$1.30 | C1.1 16.03,118.47 16.51,118.96 16.76,118.7 16.76,118.41 U$1.33 16.65,119.73 16.89,119.97 20.19,119.97 20.45,119.72 20.45,118.31 U$1.30 | 80.01,136.99 80.26,136.99 | 125.48,139.78 v125.48,139.53 125.35,139.53 124.97,139.91 119.58,139.91 119.57,139.9 81.77,139.9 80.14,138.26 80.14,137.12 80.01,136.99 | 124.21,115.15 121.41,115.15 120.65,115.91 U$2.33 | 124.21,115.15 v125.48,115.15 128.02,115.15 128.27,115.4 U$2.27 | 124.21,115.15 124.46,115.4 U$2.30 124.58,118.42 C3.1 | C8.1 80.86,134.29 80.77,134.2 | U$1.30 20.46,119.48 20.95,119.97 23.88,119.97 24.26,119.59 24.26,118.31 U$1.27 24.27,119.6 24.64,119.97 29.85,119.97 30.13,119.69 30.86,118.96 35.08,118.96 38.24,115.8 47.26,115.8 47.62,116.16 R1.1 R6.1 R3.1 48.33,120.58 48.39,120.64 48.39,121.24 48.58,121.44 C2.1 v45.47,122.77 | 45.59,140.8 45.97,140.8 | 44.7,140.8 44.7,140.42 v45.47,139.66
  Top 1.016: R22.1 23.3,141.5 24,140.8 44.7,140.8 45.59,140.8 55.63,140.8 58.67,137.75 61.72,137.75 | 61.72,137.75 64.77,137.75 65.53,136.99 66.77,136.99 R9.1 | 62.01,137.46 61.72,137.75
  Top 1.676: D4.C 22.4,150.95 R23.1 R22.1
  Bottom 0.508: v125.48,139.53 v125.48,115.15 125.48,114.89 | v45.47,139.66 v45.47,122.77

## Text on the board
Dimension: FRONT
tPlace: !RST | !PRG | !PRG | RX | TX